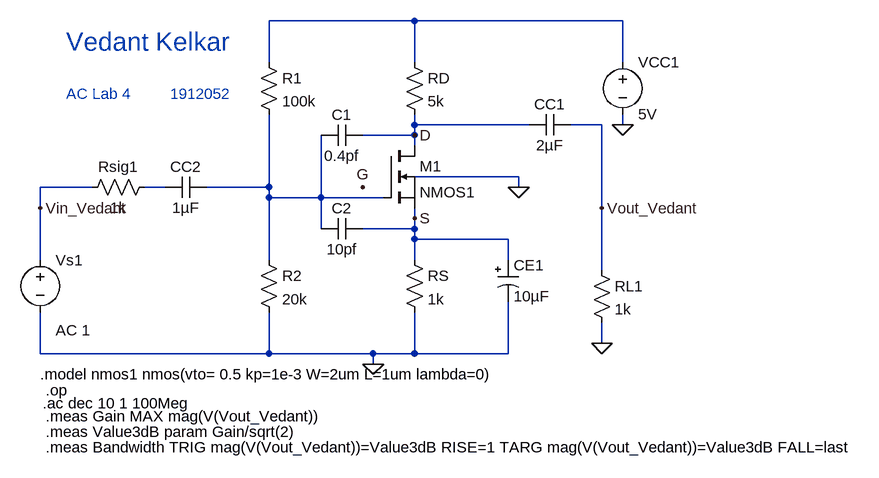
[diagram p0: schematic AC_lab4.asc]
AC_lab4.asc, the LTspice schematic file:
Version 4
SHEET 1 1396 680
WIRE 624 -48 400 -48
WIRE 944 -48 624 -48
WIRE 400 16 400 -48
WIRE 624 16 624 -48
WIRE 944 16 944 -48
WIRE 624 112 624 96
WIRE 800 112 624 112
WIRE 912 112 864 112
WIRE 944 112 944 96
WIRE 624 128 624 112
WIRE 624 128 544 128
WIRE 624 144 624 128
WIRE 784 192 624 192
WIRE 128 208 48 208
WIRE 240 208 208 208
WIRE 400 208 400 96
WIRE 400 208 304 208
WIRE 784 208 784 192
WIRE 400 224 400 208
WIRE 480 224 480 128
WIRE 480 224 400 224
WIRE 576 224 480 224
WIRE 48 240 48 208
WIRE 912 240 912 112
WIRE 624 256 624 240
WIRE 480 272 480 224
WIRE 624 272 624 256
WIRE 624 272 544 272
WIRE 624 288 624 272
WIRE 768 288 624 288
WIRE 48 320 48 240
WIRE 400 320 400 224
WIRE 624 320 624 288
WIRE 768 320 768 288
WIRE 912 336 912 240
WIRE 912 448 912 416
WIRE 48 464 48 400
WIRE 400 464 400 400
WIRE 400 464 48 464
WIRE 560 464 400 464
WIRE 624 464 624 400
WIRE 624 464 560 464
WIRE 768 464 768 384
WIRE 768 464 624 464
WIRE 560 480 560 464
FLAG 912 448 0
FLAG 944 112 0
FLAG 560 480 0
FLAG 48 240 Vin_Vedant
FLAG 912 240 Vout_Vedant
FLAG 544 208 G
FLAG 624 256 S
FLAG 624 128 D
FLAG 784 208 0
SYMBOL res 384 0 R0
SYMATTR InstName R1
SYMATTR Value 100k
SYMBOL res 608 0 R0
SYMATTR InstName RD
SYMATTR Value 5k
SYMBOL res 608 304 R0
SYMATTR InstName RS
SYMATTR Value 1k
SYMBOL res 384 304 R0
SYMATTR InstName R2
SYMATTR Value 20k
SYMBOL res 224 192 R90
WINDOW 0 0 56 VBottom 2
WINDOW 3 32 56 VTop 2
SYMATTR InstName Rsig1
SYMATTR Value 1k
SYMBOL voltage 48 304 R0
WINDOW 123 24 124 Left 2
WINDOW 39 0 0 Left 0
SYMATTR Value2 AC 1
SYMATTR InstName Vs1
SYMATTR Value ""
SYMBOL res 896 320 R0
SYMATTR InstName RL1
SYMATTR Value 1k
SYMBOL polcap 752 320 R0
WINDOW 3 24 56 Left 2
SYMATTR Value 10µF
SYMATTR InstName CE1
SYMATTR Description Capacitor
SYMATTR Type cap
SYMATTR SpiceLine V=6.3 Irms=2.21565 Rser=0.055 Lser=0 mfg="KEMET" pn="A700V106M006ATE055" type="Al electrolytic"
SYMBOL voltage 944 0 R0
SYMATTR InstName VCC1
SYMATTR Value 5V
SYMBOL cap 864 96 R90
WINDOW 0 0 32 VBottom 2
WINDOW 3 32 32 VTop 2
SYMATTR InstName CC1
SYMATTR Value 2µF
SYMBOL cap 304 192 R90
WINDOW 0 0 32 VBottom 2
WINDOW 3 32 32 VTop 2
SYMATTR InstName CC2
SYMATTR Value 1µF
SYMBOL nmos 576 144 R0
SYMATTR InstName M1
SYMATTR Value NMOS1
SYMBOL cap 544 112 R90
WINDOW 0 0 32 VBottom 2
WINDOW 3 32 32 VTop 2
SYMATTR InstName C1
SYMATTR Value 0.4pf
SYMBOL cap 544 256 R90
WINDOW 0 0 32 VBottom 2
WINDOW 3 32 32 VTop 2
SYMATTR InstName C2
SYMATTR Value 10pf
TEXT 88 -16 Left 4 ;Vedant Kelkar
TEXT 88 64 Left 2 ;AC Lab 4
TEXT 248 64 Left 2 ;1912052
TEXT 48 496 Left 2 !.model nmos1 nmos(vto= 0.5 kp=1e-3 W=2um L=1um lambda=0)
TEXT 56 520 Left 2 !.op
TEXT 52 540 Left 2 !.ac dec 10 1 100Meg
TEXT 56 560 Left 2 !.meas Gain MAX mag(V(Vout_Vedant))
TEXT 56 584 Left 2 !.meas Value3dB param Gain/sqrt(2)
TEXT 56 608 Left 2 !.meas Bandwidth TRIG mag(V(Vout_Vedant))=Value3dB RISE=1 TARG mag(V(Vout_Vedant))=Value3dB FALL=last

The netlist it stands for:
* AC_lab4.asc
R1 N001 N003 100k
RD N001 D 5k
RS S 0 1k
R2 N003 0 20k
Rsig1 N002 Vin_Vedant 1k
Vs1 Vin_Vedant 0 AC 1
RL1 Vout_Vedant 0 1k
CE1 S 0 10µF V=6.3 Irms=2.21565 Rser=0.055 Lser=0 mfg="KEMET" pn="A700V106M006ATE055" type="Al electrolytic"
VCC1 N001 0 5V
CC1 Vout_Vedant D 2µF
CC2 N003 N002 1µF
M1 D N003 S S NMOS1
C1 D N003 0.4pf
C2 S N003 10pf
.model NMOS NMOS
.model PMOS PMOS
.lib standard.mos
* Vedant Kelkar
* AC Lab 4
* 1912052
.model nmos1 nmos(vto= 0.5 kp=1e-3 W=2um L=1um lambda=0)
.op
.ac dec 10 1 100Meg
.meas Gain MAX mag(V(Vout_Vedant))
.meas Value3dB param Gain/sqrt(2)
.meas Bandwidth TRIG mag(V(Vout_Vedant))=Value3dB RISE=1 TARG mag(V(Vout_Vedant))=Value3dB FALL=last
.backanno
.end